# EAGLE design 1LFO (EAGLE 7.1.0)
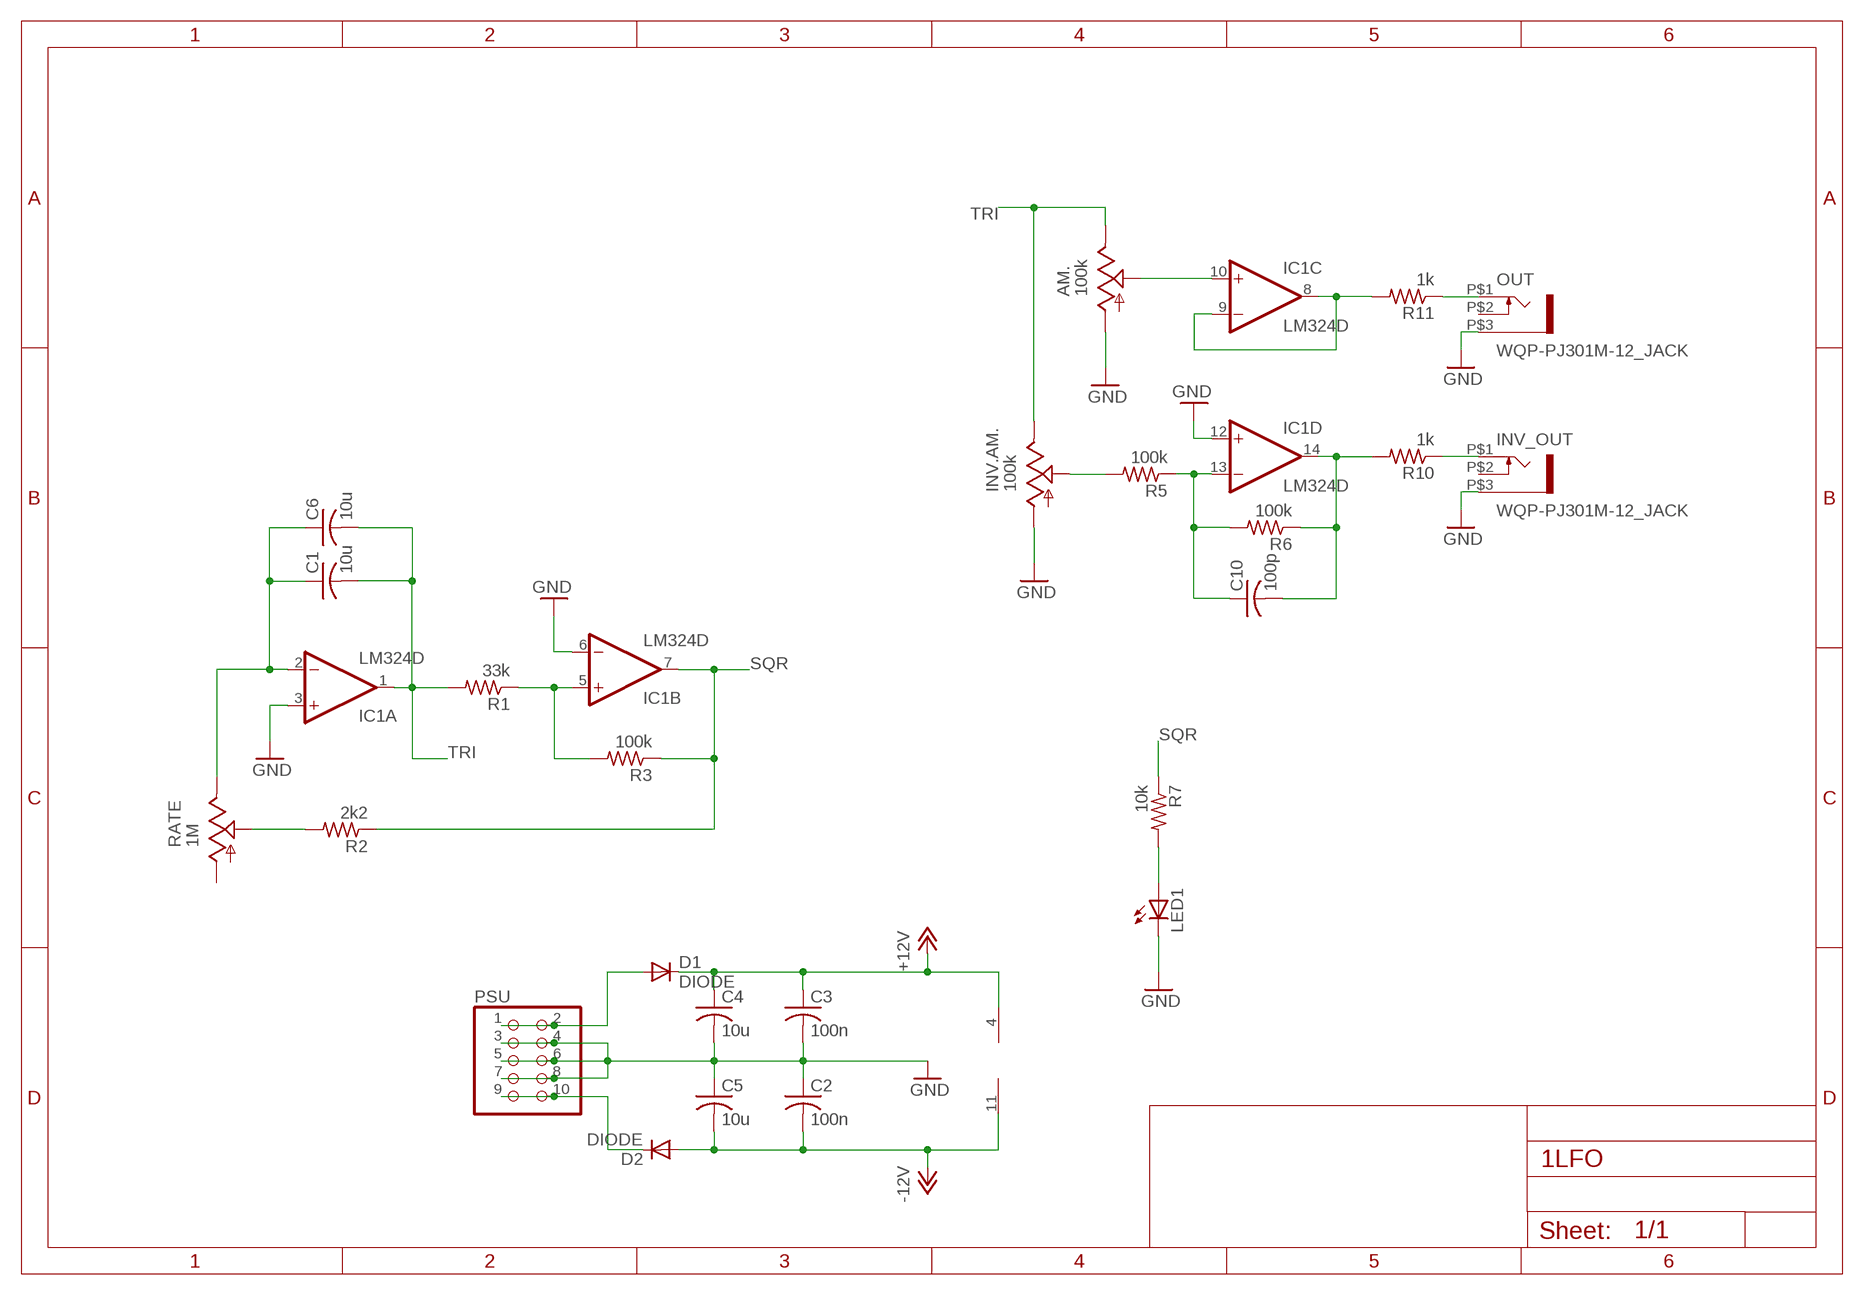
[diagram p0: schematic, sheet 1]

## Parts
AM.  100k  POT_USVERTICAL  [ALPS_POT_VERTICAL]
C1  10u  C-USC1206K  [C1206K]
C2  100n  C-USC0603K  [C0603K]
C3  100n  C-USC0603K  [C0603K]
C4  10u  C-USC1206K  [C1206K]
C5  10u  C-USC1206K  [C1206K]
C6  10u  C-USC0603K  [C0603K]
C10  100p  C-USC0603K  [C0603K]
D1  DIODE  DIODE-DO214AA  [DO214AA]
D2  DIODE  DIODE-DO214AA  [DO214AA]
IC1  LM324D  [SO14]
INV.AM.  100k  POT_USVERTICAL  [ALPS_POT_VERTICAL]
INV_OUT  WQP-PJ301M-12_JACK  [WQP-PJ301M-12_JACK]
LED1  LED3MM  [LED3MM]
OUT  WQP-PJ301M-12_JACK  [WQP-PJ301M-12_JACK]
PSU  PINHD-2X5  [2X05]
R1  33k  R-US_R0603  [R0603]
R2  2k2  R-US_R0603  [R0603]
R3  100k  R-US_R0603  [R0603]
R5  100k  R-US_R0603  [R0603]
R6  100k  R-US_R0603  [R0603]
R7  10k  R-US_R0603  [R0603]
R10  1k  R-US_R0603  [R0603]
R11  1k  R-US_R0603  [R0603]
RATE  1M  POT_USVERTICAL  [ALPS_POT_VERTICAL]

## Nets
+12V: C3.1 C4.1 D1.C IC1.4(P:V+)
-12V: C2.2 C5.2 D2.A IC1.11(P:V-)
GND: AM..P$3(A) C2.1 C3.2 C4.2 C5.1 IC1.3(A:+IN) IC1.6(B:-IN) IC1.12(D:+IN) INV.AM..P$3(A) INV_OUT.P$3 LED1.K(C) OUT.P$3 PSU.3 PSU.4 PSU.5 PSU.6 PSU.7 PSU.8
N$1: C1.1 C6.1 IC1.2(A:-IN) RATE.P$1(E)
N$4: INV.AM..P$2(S) R5.2
N$5: IC1.5(B:+IN) R1.1 R3.2
N$7: R2.2 RATE.P$2(S)
N$8: IC1.8(C:OUT) IC1.9(C:-IN) R11.2
N$9: AM..P$2(S) IC1.10(C:+IN)
N$10: D1.A PSU.1 PSU.2
N$11: D2.C PSU.9 PSU.10
N$12: C10.1 IC1.13(D:-IN) R5.1 R6.2
N$13: LED1.A R7.2
N$14: C10.2 IC1.14(D:OUT) R6.1 R10.2
N$17: OUT.P$1 R11.1
N$19: INV_OUT.P$1 R10.1
SQR: IC1.7(B:OUT) R2.1 R3.1 R7.1
TRI: AM..P$1(E) C1.2 C6.2 IC1.1(A:OUT) INV.AM..P$1(E) R1.2
Unconnected: INV_OUT.P$2 OUT.P$2 RATE.P$3(A)

## Library data of the parts
AM. INV.AM. RATE = pot-alps:POT_US
C1-C6 C10 = rcl:C-US: CAPACITOR, American symbol
D1 D2 = diode:DIODE-: DIODE
IC1 = linear:LM324: OP AMP
INV_OUT OUT = thonkiconn:WQP-PJ301M-12_JACK
LED1 = led:LED: LED OSRAM: - CHIPLED LG R971, LG N971, LY N971, LG Q971, LY Q971, LO R971, LY R971 LH N974, LH R974 LS Q976, LO Q976, LY Q976 LO Q996 - Hyper CHIPLED LW Q18S LB Q993, LB Q99A, LB R99A - SideLED LS A670, LO A670, LY A670, LG A670, LP A670 LB A673, LV A673, LT A673, LW A673 LH A674 LY A675 LS A676, LA A676, LO A676, LY A676, LW A676 LS A679, LY A679, LG A679 - Hyper Micro SIDELED® LS Y876, LA Y876, LO Y876, LY Y876 LT Y87S - SmartLED LW L88C, LW L88S LB L89C, LB L89S, LG L890 LS L89K, LO L89K, LY L89K LS L896, LA L896, LO L896, LY L896 - TOPLED LS T670, LO T670, LY T670, LG T670, LP T670 LSG T670, LSP T670, LSY T670, LOP T670, LYG T670 LG T671, LOG T671, LSG T671 LB T673, LV T673, LT T673, LW T673 LH T674 LS T676, LA T676, LO T676, LY T676, LB T676, LH T676, LSB T676, LW T676 LB T67C, LV T67C, LT T67C, LS T67K, LO T67K, LY T67K, LW E67C LS E67B, LA E67B, LO E67B, LY E67B, LB E67C, LV E67C, LT E67C LW T67C LS T679, LY T679, LG T679 LS T770, LO T770, LY T770, LG T770, LP T770 LB T773, LV T773, LT T773, LW T773 LH T774 LS E675, LA E675, LY E675, LS T675 LS T776, LA T776, LO T776, LY T776, LB T776 LHGB T686 LT T68C, LB T68C - Hyper Mini TOPLED® LB M676 - Mini TOPLED Santana® LG M470 LS M47K, LO M47K, LY M47K Source: http://www.osram.convergy.de LUXEON: - LUMILED® LXK2-PW12-R00, LXK2-PW12-S00, LXK2-PW14-U00, LXK2-PW14-V00 LXK2-PM12-R00, LXK2-PM12-S00, LXK2-PM14-U00 LXK2-PE12-Q00, LXK2-PE12-R00, LXK2-PE12-S00, LXK2-PE14-T00, LXK2-PE14-U00 LXK2-PB12-K00, LXK2-PB12-L00, LXK2-PB12-M00, LXK2-PB14-N00, LXK2-PB14-P00, LXK2-PB14-Q00 LXK2-PR12-L00, LXK2-PR12-M00, LXK2-PR14-Q00, LXK2-PR14-R00 LXK2-PD12-Q00, LXK2-PD12-R00, LXK2-PD12-S00 LXK2-PH12-R00, LXK2-PH12-S00 LXK2-PL12-P00, LXK2-PL12-Q00, LXK2-PL12-R00 Source: www.luxeon.com KINGBRIGHT: KA-3528ASYC Source: www.kingbright.com
PSU = pinhead:PINHD-2X5: PIN HEADER
R1-R3 R5-R7 R10 R11 = rcl:R-US_: RESISTOR, American symbol

## Board
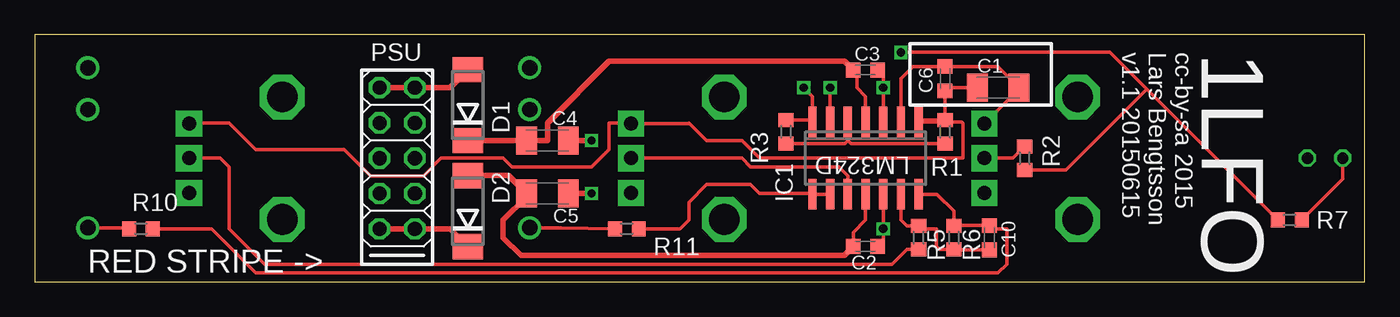
[diagram p1: board, top side]
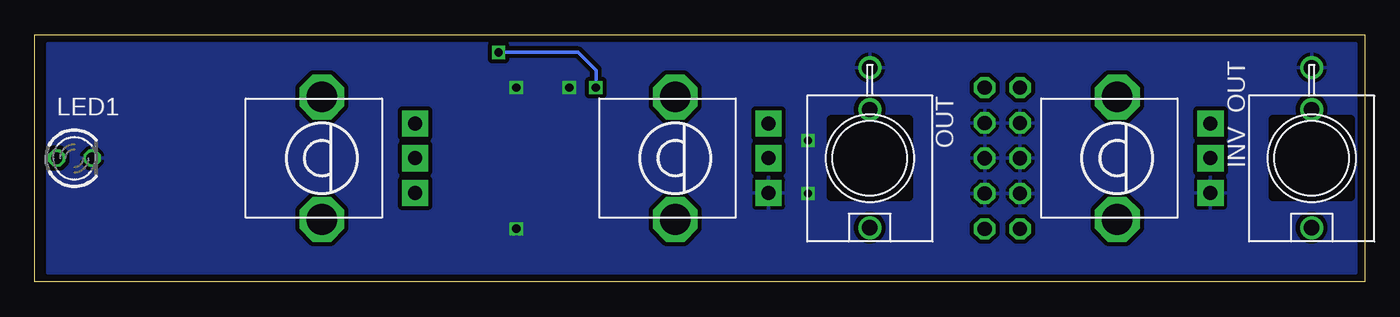
[diagram p2: board, bottom side, seen from below]

Size 95.55 x 17.77 mm. Coordinates in mm from the lower left corner, seen from the top.
Outline: 0,0 95.55,0 95.55,17.77 0,17.77 0,0
Copper layers (1*16): Top 0.0356mm / dielectric 1.5011mm / Bottom 0.0356mm
Design rules "LaenPCBOrder": minimum track width 6mil, minimum drill 13mil, track to track 6mil, track to pad 6mil, pad to pad 6mil, via to via 6mil, smd to smd 6mil, copper to edge 15mil, drill to drill 6mil, minimum pad ring 7mil, minimum via ring 7mil, stop-mask expansion 3mil, vias tented up to drill 0mil, thermal gap 10mil

### Footprints (pad centres in the part's own frame; a part is rotated, then mirrored left to right if it is on the bottom)
ALPS_POT_VERTICAL = drill 1 pad 1.88 square: P$1 -2.5,6.7; P$2 0,6.7; P$3 2.5,6.7 | drill 2.2 pad 3.175 octagon: P$4 -4.4,0; P$5 4.4,0
C1206K = smd 1.5 x 2: 1 -1.5,0; 2 1.5,0
C0603K = smd 1.05 x 1.08: 1 -0.875,0; 2 0.875,0
DO214AA = smd 1.8 x 2.2: A 2.55,0; C -2.55,0
SO14 = smd 0.6 x 2.2: 1 -3.81,-2.6; 2 -2.54,-2.6; 3 -1.27,-2.6; 4 0,-2.6; 5 1.27,-2.6; 6 2.54,-2.6; 7 3.81,-2.6; 8 3.81,2.6; 9 2.54,2.6; 10 1.27,2.6; 11 0,2.6; 12 -1.27,2.6; 13 -2.54,2.6; 14 -3.81,2.6
WQP-PJ301M-12_JACK = drill 1.1: P$1 0,5; P$2 0,-3.5; P$3 0,-6.5
LED3MM = drill 0.813 octagon: A -1.27,0; K 1.27,0
2X05 = drill 1.016 octagon: 1 -5.08,-1.27; 2 -5.08,1.27; 3 -2.54,-1.27; 4 -2.54,1.27; 5 0,-1.27; 6 0,1.27; 7 2.54,-1.27; 8 2.54,1.27; 9 5.08,-1.27; 10 5.08,1.27
R0603 = smd 1 x 1.1: 1 -0.85,0; 2 0.85,0

### Placement (x,y rotation side)
AM.  49.53,8.89 270 bottom
C1  69.22,13.97 180 top
C2  59.69,2.54 180 top
C3  59.69,15.24 0 top
C4  36.83,10.16 0 top
C5  36.83,6.35 180 top
C6  65.41,14.61 270 top
C10  68.58,3.18 90 top
D1  31.11,12.7 90 top
D2  31.11,5.08 90 top
IC1  59.69,8.89 180 top
INV.AM.  17.78,8.89 270 bottom
INV_OUT  3.81,8.89 180 bottom
LED1  92.71,8.89 0 bottom
OUT  35.56,8.89 180 bottom
PSU  26.04,8.89 270 top
R1  65.41,10.79 90 top
R2  71.12,8.89 90 top
R3  53.97,10.79 270 top
R5  63.5,3.18 270 top
R6  66.04,3.18 270 top
R7  90.17,4.45 0 top
R10  7.62,3.81 0 top
R11  42.54,3.81 0 top
RATE  74.93,8.89 270 bottom

### Tracks (layer width: path | path; a pad name or v marks a point on that pad's centre or on a via)
+12V
  Top 0.254: IC1.4 59.69,13.34 59.05,13.97 59.05,15 C3.1
  Top 0.406: D1.C 34.05,10.15 C4.1 36.83,10.16 36.83,11.43 41.27,15.88 58.18,15.88 C3.1
-12V
  Top 0.254: C2.2 58.81,3.57 59.69,4.45 IC1.11
  Top 0.406: D2.A 34.05,7.63 C5.2 35.33,6.12 33.66,4.45 33.66,3.18 34.92,1.9 58.18,1.9 C2.2
GND  (via drill 0.6)
  Top 0.254: 60.96,11.43 IC1.3 v60.96,13.97 60.96,14.84 C3.2 | IC1.6 v57.15,13.97 | IC1.12 v60.96,3.81 60.96,2.94 C2.1
  Top 0.406: C5.1 v40,6.35 | C4.2 v40,10.16
  pour Bottom (isolate 0.305): 0.64,17.14 94.61,17.14 94.61,0.64 0.64,0.64
N$1
  Top 0.254: IC1.2 62.23,14.61 63.11,15.48 C6.1 69.2,15.48 C1.1 70.72,13.88 RATE.P$1
N$4
  Top 0.254: R5.2 62.65,2.33 61.59,1.27 16.51,1.27 13.97,3.81 13.97,8.26 13.33,8.89 INV.AM..P$2
N$5
  Top 0.254: R3.2 58.2,9.95 58.42,10.16 | 58.42,10.16 IC1.5 | R1.1 58.63,9.95 58.42,10.16
N$7
  Top 0.254: RATE.P$2 70.27,8.89 R2.2
N$8
  Top 0.254: IC1.9 IC1.8 55.82,6.35 52.07,6.35 51.43,6.99 48.26,6.99 46.99,5.71 46.99,4.45 46.35,3.81 R11.2
N$9
  Top 0.254: AM..P$2 50.8,8.89 51.43,8.26 57.78,8.26 58.42,7.62 IC1.10
N$10
  Top 0.406: PSU.1 PSU.2 29.84,13.97 D1.A
N$11
  Top 0.406: PSU.9 PSU.10 29.84,3.81 D2.C
N$12
  Top 0.254: C10.1 66.06,2.3 R6.2 64.98,2.33 64.77,2.54 64.77,3.81 63.72,3.81 R5.1 62.65,4.03 62.23,4.45 IC1.13
N$13
  Top 0.254: LED1.A 93.98,7.41 R7.2
N$14
  Top 0.254: IC1.14 64.83,6.29 66.04,5.08 R6.1 66.06,4.05 C10.2 68.82,3.81 69.85,3.81 69.85,1.27 69.22,0.64 15.87,0.64 12.7,3.81 R10.2
N$17
  Top 0.254: OUT.P$1 37.8,3.89 R11.1
N$19
  Top 0.254: INV_OUT.P$1 6.69,3.89 R10.1
SQR  (via drill 0.6)
  Top 0.254: R3.1 55.72,11.64 IC1.7 55.88,13.34 v55.24,13.97 | v62.23,16.51 77.25,16.51 79.9,13.86 | 79.9,13.86 R7.1 | R2.1 74.08,8.04 79.9,13.86
  Bottom 0.254: v55.24,13.97 55.24,15.24 56.52,16.51 v62.23,16.51
TRI
  Top 0.254: INV.AM..P$1 11.12,11.43 13.97,11.43 15.87,9.53 22.23,9.53 24.13,7.62 27.94,7.62 29.21,8.89 33.66,8.89 34.29,8.26 40,8.26 41.27,9.53 41.27,11.43 42.79,11.43 AM..P$1 46.95,11.39 46.99,11.43 48.26,10.16 50.8,10.16 52.07,8.89 66.67,8.89 66.67,11.43 66.61,11.49 IC1.1 63.66,11.64 R1.2 C6.2 65.64,13.97 C1.2

### Text on the board
tNames: cc-by-sa 2015 / Lars Bengtsson / v1.1 20150615 | 1LFO | RED STRIPE ->